# EAGLE design 2LCI2C (EAGLE 9.6.2)
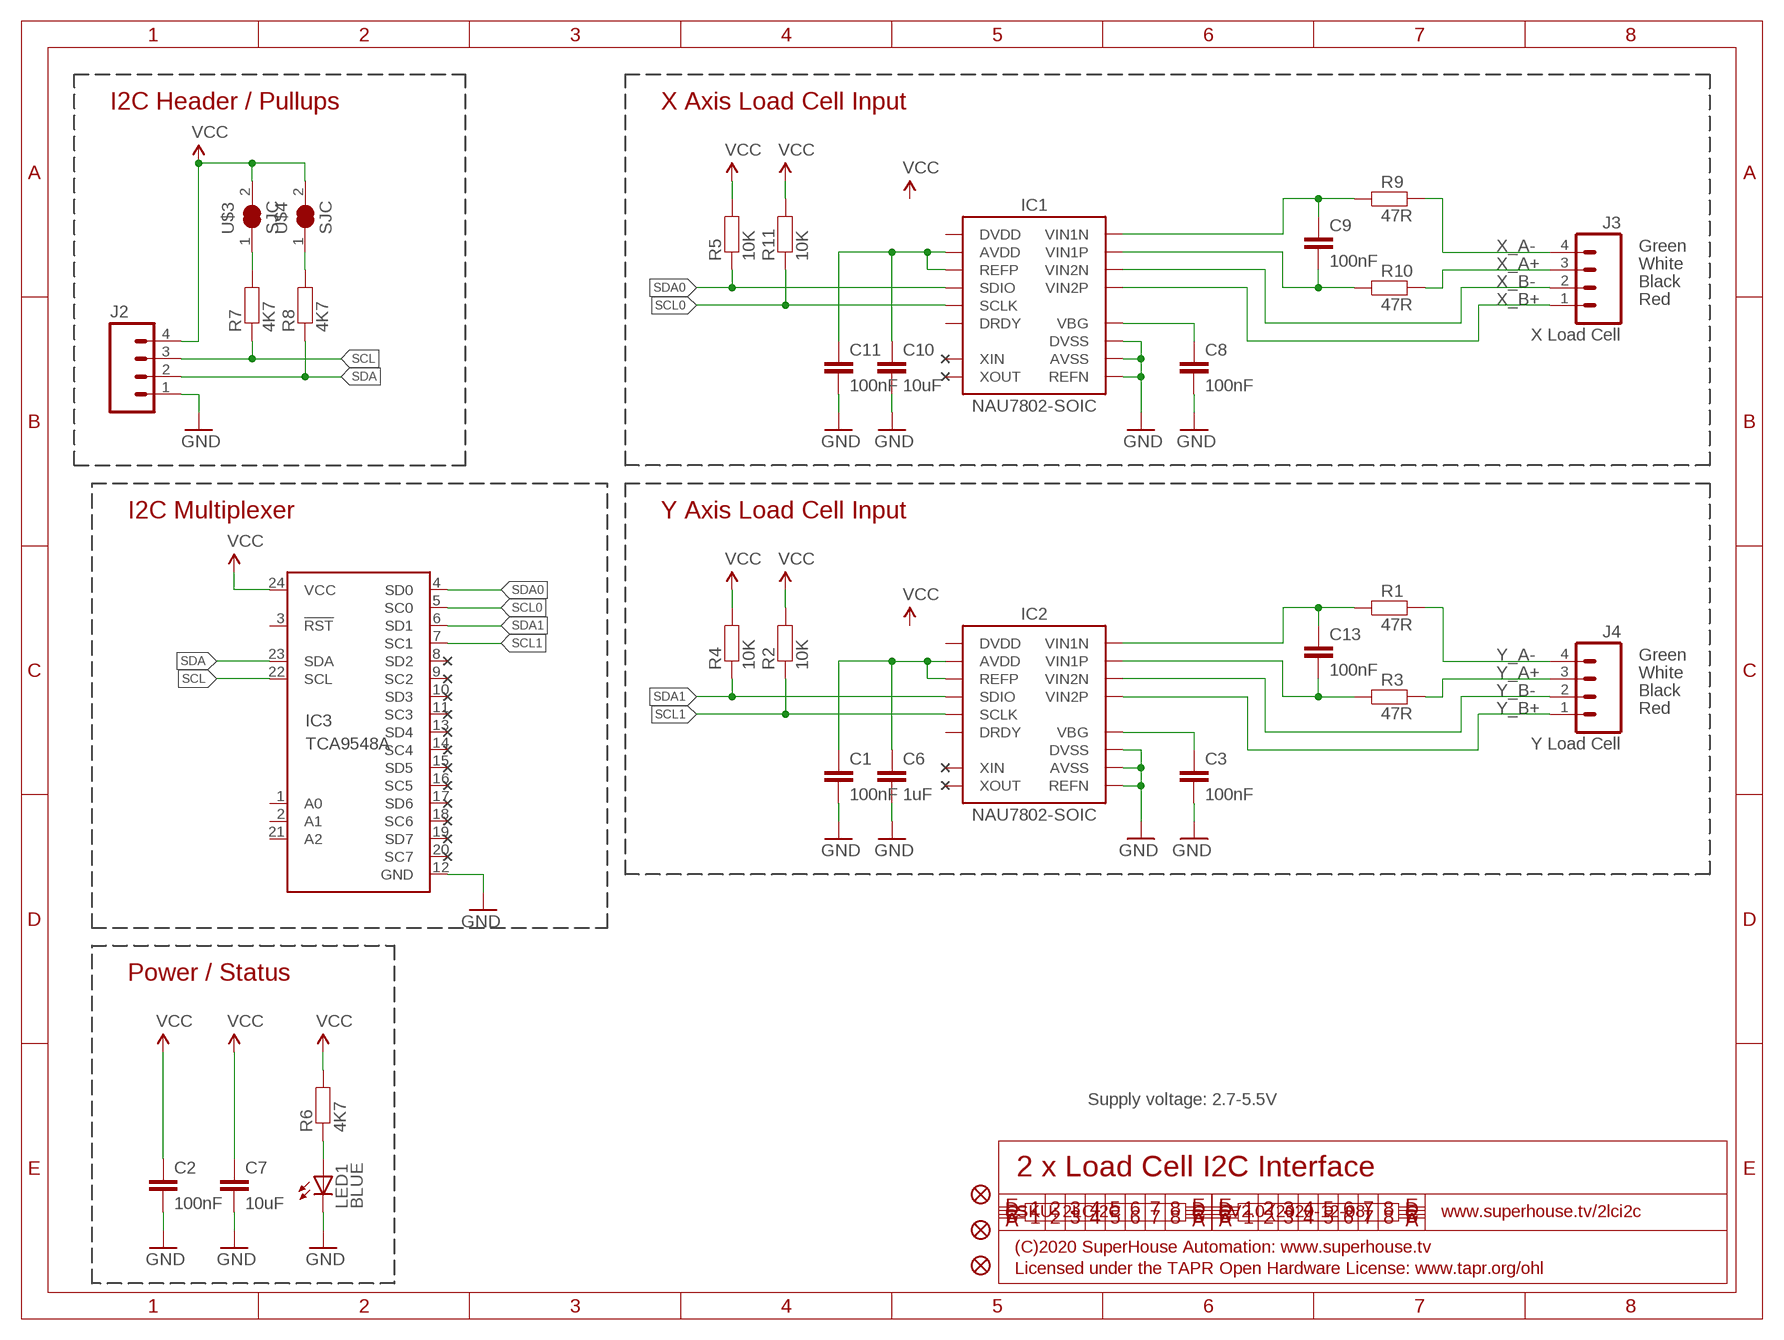
[diagram p0: schematic, sheet 1]

## Parts
C1  100nF  CAP0603  [C0603]
C2  100nF  CAP0603  [C0603]
C3  100nF  CAP0603  [C0603]
C6  1uF  CAP0805  [C0805]
C7  10uF  CAP0805  [C0805]
C8  100nF  CAP0603  [C0603]
C9  100nF  CAP0603  [C0603]
C10  10uF  CAP0805  [C0805]
C11  100nF  CAP0603  [C0603]
C13  100nF  CAP0603  [C0603]
IC1  NAU7802-SOIC  [SO16]
IC2  NAU7802-SOIC  [SO16]
IC3  TCA9548A  [TSSOP24]
J2  M04-PLAIN  [1X04]
J3  X Load Cell  M04-1.27-PLAIN  [1X04-1.27-PLAIN]
J4  Y Load Cell  M04-1.27-PLAIN  [1X04-1.27-PLAIN]
LED1  BLUE  LED0603  [LED-0603]
R1  47R  RESISTOR0603  [R0603]
R2  10K  RESISTOR0603  [R0603]
R3  47R  RESISTOR0603  [R0603]
R4  10K  RESISTOR0603  [R0603]
R5  10K  RESISTOR0603  [R0603]
R6  4K7  RESISTOR0603  [R0603]
R7  4K7  RESISTOR0603  [R0603]
R8  4K7  RESISTOR0603  [R0603]
R9  47R  RESISTOR0603  [R0603]
R10  47R  RESISTOR0603  [R0603]
R11  10K  RESISTOR0603  [R0603]
U$3  SJC  SJC-NORMAL  [SJC]
U$4  SJC  SJC-NORMAL  [SJC]
U$5  FIDUCIAL1X2.5  [FIDUCIAL-1X2.5]
U$10  FIDUCIAL1X2.5  [FIDUCIAL-1X2.5]
U$11  FIDUCIAL1X2.5  [FIDUCIAL-1X2.5]

## Nets
GND: C1.2 C2.2 C3.2 C6.2 C7.2 C8.2 C10.2 C11.2 IC1.7(REFN) IC1.8(AVSS) IC1.9(DVSS) IC2.7(REFN) IC2.8(AVSS) IC2.9(DVSS) IC3.12(GND) J2.1 LED1.C
N$1: C3.1 IC2.6(VBG)
N$2: C13.1 IC2.2(VIN1N) R1.1
N$3: C1.1 C6.1 IC2.1(REFP) IC2.16(AVDD)
N$4: C13.2 IC2.3(VIN1P) R3.1
N$5: LED1.A R6.1
N$6: C9.1 IC1.2(VIN1N) R9.1
N$7: C9.2 IC1.3(VIN1P) R10.1
N$8: C8.1 IC1.6(VBG)
N$9: C10.1 C11.1 IC1.1(REFP) IC1.16(AVDD)
N$11: R7.2 U$3.1
N$12: R8.2 U$4.1
SCL: IC3.22(SCL) J2.3 R7.1
SCL0: IC1.13(SCLK) IC3.5(SC0) R11.1
SCL1: IC2.13(SCLK) IC3.7(SC1) R2.1
SDA: IC3.23(SDA) J2.2 R8.1
SDA0: IC1.14(SDIO) IC3.4(SD0) R5.1
SDA1: IC2.14(SDIO) IC3.6(SD1) R4.1
VCC: C2.1 C7.1 IC3.24(VCC) J2.4 R2.2 R4.2 R5.2 R6.2 R11.2 U$3.2 U$4.2
X_A+: J3.3 R10.2
X_A-: J3.4 R9.2
X_B+: IC1.5(VIN2P) J3.1
X_B-: IC1.4(VIN2N) J3.2
Y_A+: J4.3 R3.2
Y_A-: J4.4 R1.2
Y_B+: IC2.5(VIN2P) J4.1
Y_B-: IC2.4(VIN2N) J4.2
Unconnected: IC1.10(XIN) IC1.11(XOUT) IC1.12(DRDY) IC1.15(DVDD) IC2.10(XIN) IC2.11(XOUT) IC2.12(DRDY) IC2.15(DVDD) IC3.1(A0) IC3.2(A1) IC3.3(!RST) IC3.8(SD2) IC3.9(SC2) IC3.10(SD3) IC3.11(SC3) IC3.13(SD4) IC3.14(SC4) IC3.15(SD5) IC3.16(SC5) IC3.17(SD6) IC3.18(SC6) IC3.19(SD7) IC3.20(SC7) IC3.21(A2)

## Notes on the sheet
- I2C Header / Pullups | X Axis Load Cell Input
- Green
- White
- Black
- Red
- I2C Multiplexer | Y Axis Load Cell Input
- Green
- White
- Black
- Red
- Power / Status
- Supply voltage: 2.7-5.5V
- 2 x Load Cell I2C Interface
- SKU: 2LCI2C | V2.0 (2020-12-08) | www.superhouse.tv/2lci2c
- (C)2020 SuperHouse Automation: www.superhouse.tv
- Licensed under the TAPR Open Hardware License: www.tapr.org/ohl

## Library data of the parts
C1-C3 C6-C11 C13 = SuperHouse-DiscreteSemi:CAP: Capacitor Standard ceramic capacitor
IC1 IC2 = SuperHouse-ICs:NAU7802: 24-bit load cell conversion IC with I2C interface in SOIC-16 package. Similar to HX711 but with true I2C interface.; PROD_ID: IC-14299
IC3 = SuperHouse-ICs:TCA9548A
J2-J4 = SuperHouse-Connectors:M04: 4-way header Standard 1x4 header, and screw terminal variations
LED1 = SuperHouse-LEDs:LED: LEDs Standard schematic elements and footprints for 5mm, 3mm, 1206, and 0603 sized LEDs. 5mm - Spark Fun Electronics SKU : COM-00529 (and others)
R1-R11 = SuperHouse-DiscreteSemi:RESISTOR: Resistor Standard resistors.
U$3 U$4 = SuperHouse-Jumpers:SJC: Solder jumper. Normally closed: does not need solder to close. Can be opened by cutting the track.
U$5 U$10 U$11 = SuperHouse-Symbols:FIDUCIAL: Fiducial Alignment Points Various fiducial points for machine vision alignment.

## Board
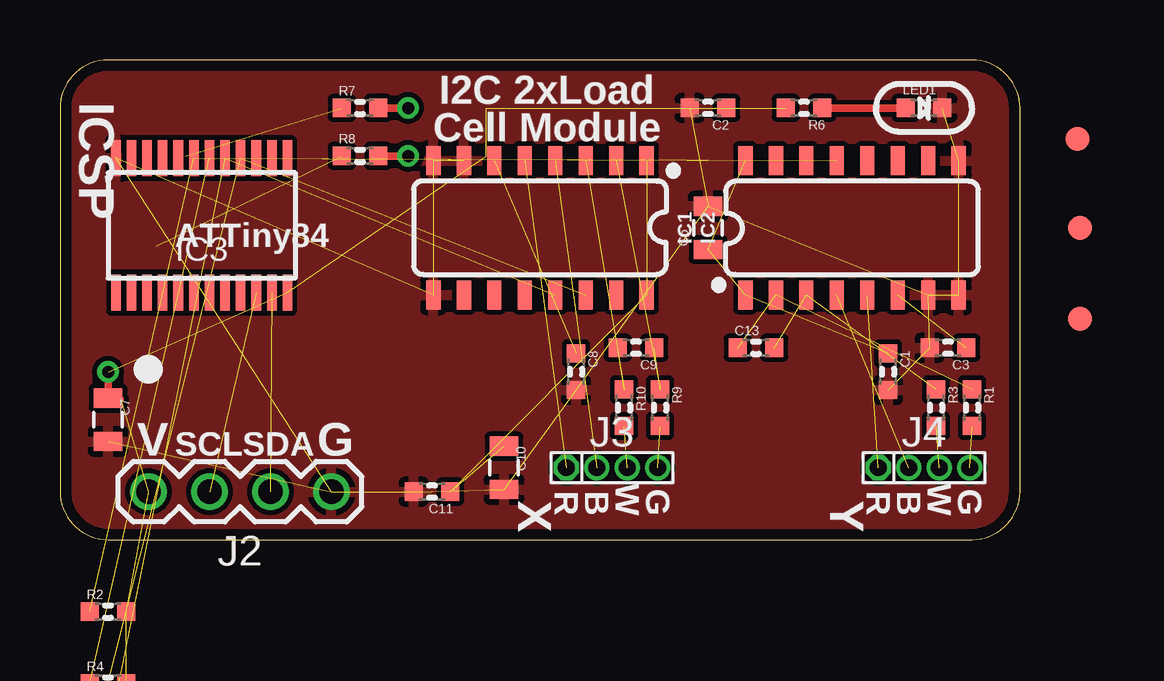
[diagram p1: board, top side]
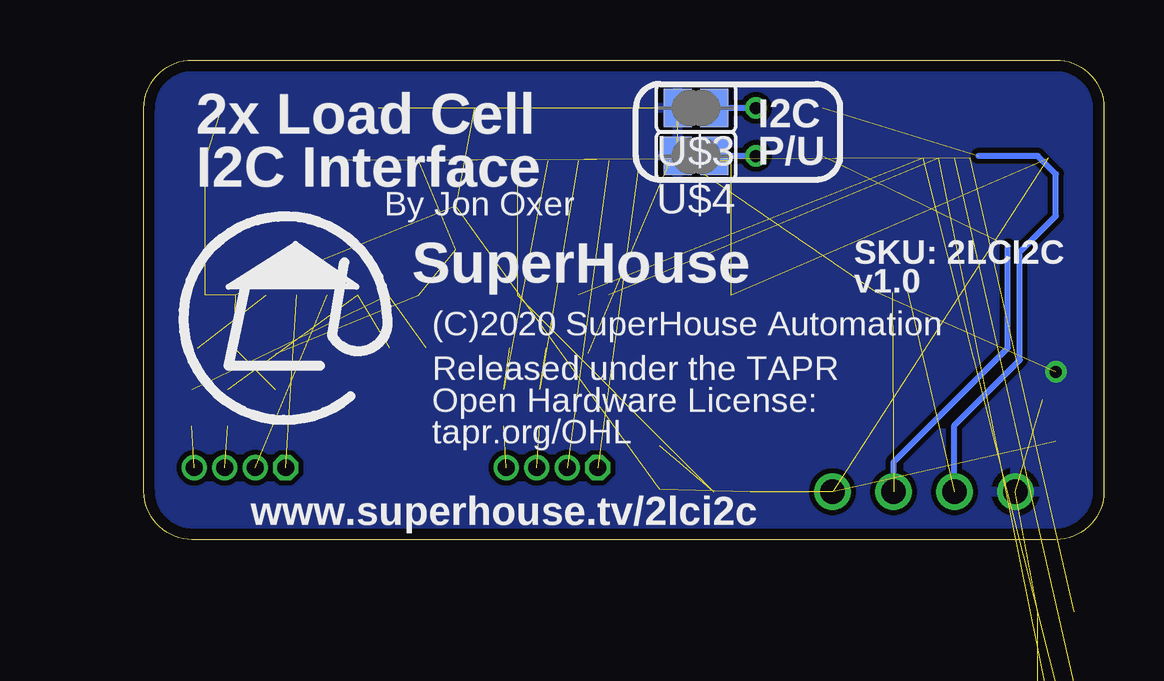
[diagram p2: board, bottom side, seen from below]

Size 40 x 20 mm. Coordinates in mm from the lower left corner, seen from the top.
Outline: 0,18 0,2 arc90 2,0 38,0 arc90 40,2 40,18 arc90 38,20 2,20 arc90 0,18
Copper layers (1*16): Top 0.035mm / dielectric 1.5mm / Bottom 0.035mm
Design rules "SuperHouse-Design-Rules": minimum track width 10mil, minimum drill 24mil, track to track 8mil, track to pad 8mil, pad to pad 8mil, via to via 8mil, smd to smd 6mil, copper to edge 18mil, drill to drill 8mil, minimum pad ring 7mil, minimum via ring 8mil, stop-mask expansion 4mil, vias tented up to drill 0.5mm, thermal gap 10mil

### Footprints (pad centres in the part's own frame; a part is rotated, then mirrored left to right if it is on the bottom)
C0603 = smd 0.762 x 0.762: 1 -0.762,0; 2 0.762,0
C0805 = smd 0.8 x 1.2: 1 -0.9,0; 2 0.9,0
SO16 = smd 0.6 x 1.2: 1 -4.445,-2.8; 2 -3.175,-2.8; 3 -1.905,-2.8; 4 -0.635,-2.8; 5 0.635,-2.8; 6 1.905,-2.8; 7 3.175,-2.8; 8 4.445,-2.8; 9 4.445,2.8; 10 3.175,2.8; 11 1.905,2.8; 12 0.635,2.8; 13 -0.635,2.8; 14 -1.905,2.8; 15 -3.175,2.8; 16 -4.445,2.8
TSSOP24 = smd 0.4 x 1.5: 1 -3.575,-2.8; 2 -2.925,-2.8; 3 -2.275,-2.8; 4 -1.625,-2.8; 5 -0.975,-2.8; 6 -0.325,-2.8; 7 0.325,-2.8; 8 0.975,-2.8; 9 1.625,-2.8; 10 2.275,-2.8; 11 2.925,-2.8; 12 3.575,-2.8; 13 3.575,2.8; 14 2.925,2.8; 15 2.275,2.8; 16 1.625,2.8; 17 0.975,2.8; 18 0.325,2.8; 19 -0.325,2.8; 20 -0.975,2.8; 21 -1.625,2.8; 22 -2.275,2.8; 23 -2.925,2.8; 24 -3.575,2.8
1X04 = drill 1.016: 1 -3.81,0; 2 -1.27,0; 3 1.27,0; 4 3.81,0
1X04-1.27-PLAIN = drill 0.7 pad 1.016 octagon: 1 -1.905,0 | drill 0.7 pad 1.016: 2 -0.635,0; 3 0.635,0; 4 1.905,0
LED-0603 = smd 0.762 x 0.762: A -0.762,0; C 0.762,0
R0603 = smd 0.762 x 0.762: 1 -0.762,0; 2 0.762,0
SJC = smd 1.168 x 1.6: 1 -0.762,0; 2 0.762,0
FIDUCIAL-1X2.5 = smd 1 x 1: 1 0,0

### Placement (x,y rotation side)
C1  34.5,7 270 top
C2  27,18 180 top
C3  37,8 180 top
C6  27,13 90 top
C7  2,5 270 top
C8  21.5,7 270 top
C9  24,8 180 top
C10  18.5,3 270 top
C11  15.5,2 180 top
C13  29,8 0 top
IC1  20,13 180 top
IC2  33,13 0 top
IC3  5.9,13.1 180 top
J2  7.5,2 180 top
J3  23,3 0 top
J4  36,3 0 top
LED1  36,18 0 top
R1  38,5.5 270 top
R2  2,-3 0 top
R3  36.5,5.5 270 top
R4  2,-6 0 top  (outside the outline)
R5  2,-9 0 top  (outside the outline)
R6  31,18 180 top
R7  12.5,18 0 top
R8  12.5,16 0 top
R9  25,5.5 270 top
R10  23.5,5.5 270 top
R11  2,-12 0 top  (outside the outline)
U$3  17,18 180 bottom
U$4  17,16 180 bottom
U$5  42.4,16.7 0 top
U$10  42.5,13 0 top
U$11  42.5,9.2 0 top

### Tracks (layer width: path | path; a pad name or v marks a point on that pad's centre or on a via)
GND  (16 unrouted)
  pour Top: 40,18 40,2 arc-90 38,0 2,0 arc-90 0,2 0,18 arc-90 2,20 38,20 arc-90
N$1  (1 unrouted)
N$2  (2 unrouted)
N$3  (3 unrouted)
N$4  (2 unrouted)
N$5
  Top 0.305: R6.1 LED1.A
N$6  (2 unrouted)
N$7  (2 unrouted)
N$8  (1 unrouted)
N$9  (3 unrouted)
N$11  (via drill 0.5)
  Top 0.305: R7.2 v14.5,18
  Bottom 0.254: v14.5,18 U$3.1
N$12  (via drill 0.5)
  Top 0.305: v14.5,16 R8.2
  Bottom 0.254: v14.5,16 U$4.1
SCL  (2 unrouted)
  Bottom 0.254: J2.3 6.23,4.77 3.5,7.5 3.5,12 2,13.5 2,15.25 2.75,16 5.23,16
SCL0  (2 unrouted)
SCL1  (2 unrouted)
SDA  (2 unrouted)
  Bottom 0.254: J2.2 8.77,3.23 4,8 4,12.23
SDA0  (2 unrouted)
SDA1  (2 unrouted)
VCC  (via drill 0.5)  (10 unrouted)
  Top 0.254: 2.55,5.85 C7.1
  Top 0.305: v2,7 C7.1
  pour Bottom: 40,18 40,2 arc-90 38,0 2,0 arc-90 0,2 0,18 arc-90 2,20 38,20 arc-90
X_A+  (1 unrouted)
X_A-  (1 unrouted)
X_B+  (1 unrouted)
X_B-  (1 unrouted)
Y_A+  (1 unrouted)
Y_A-  (1 unrouted)
Y_B+  (1 unrouted)
Y_B-  (1 unrouted)

### Text on the board
tPlace: I2C 2xLoad / Cell Module | ICSP | ATTiny84 | V | SCL | SDA | G | R | B | W | G | R | B | W | G | X | Y
bPlace: I2C / P/U | 2x Load Cell / I2C Interface | By Jon Oxer | SKU: 2LCI2C | SuperHouse | v1.0 | (C)2020 SuperHouse Automation | Released under the TAPR / Open Hardware License: / tapr.org/OHL | www.superhouse.tv/2lci2c